# EAGLE schematic flex_sensors_two_types (EAGLE 9.3.1)
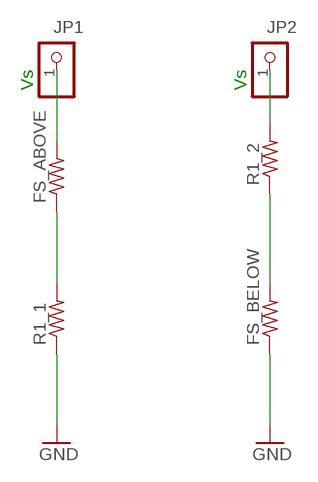
[diagram p0: schematic, sheet 1]

## Parts
FS_ABOVE  R-US_0207/5V  [0207/5V]
FS_BELOW  R-US_0207/5V  [0207/5V]
JP1  PINHD-1X1  [1X01]
JP2  PINHD-1X1  [1X01]
R1_1  R-US_0207/5V  [0207/5V]
R1_2  R-US_0207/5V  [0207/5V]

## Nets
GND: FS_BELOW.1 R1_1.1
N$1: FS_ABOVE.2 JP1.1
N$2: FS_ABOVE.1 R1_1.2
N$3: JP2.1 R1_2.2
N$4: FS_BELOW.2 R1_2.1

## Notes on the sheet
- Vs | Vs

## Library data of the parts
FS_ABOVE FS_BELOW R1_1 R1_2 = rcl:R-US_: RESISTOR, American symbol; SPICEPREFIX: R
JP1 JP2 = pinhead:PINHD-1X1: PIN HEADER